# Altium schematic sheet PG02_PPG.SchDoc: Smart Ring (Concept)
size B; DocumentNumber: 2; Revision: A; SheetNumber: 2; SheetTotal: 3
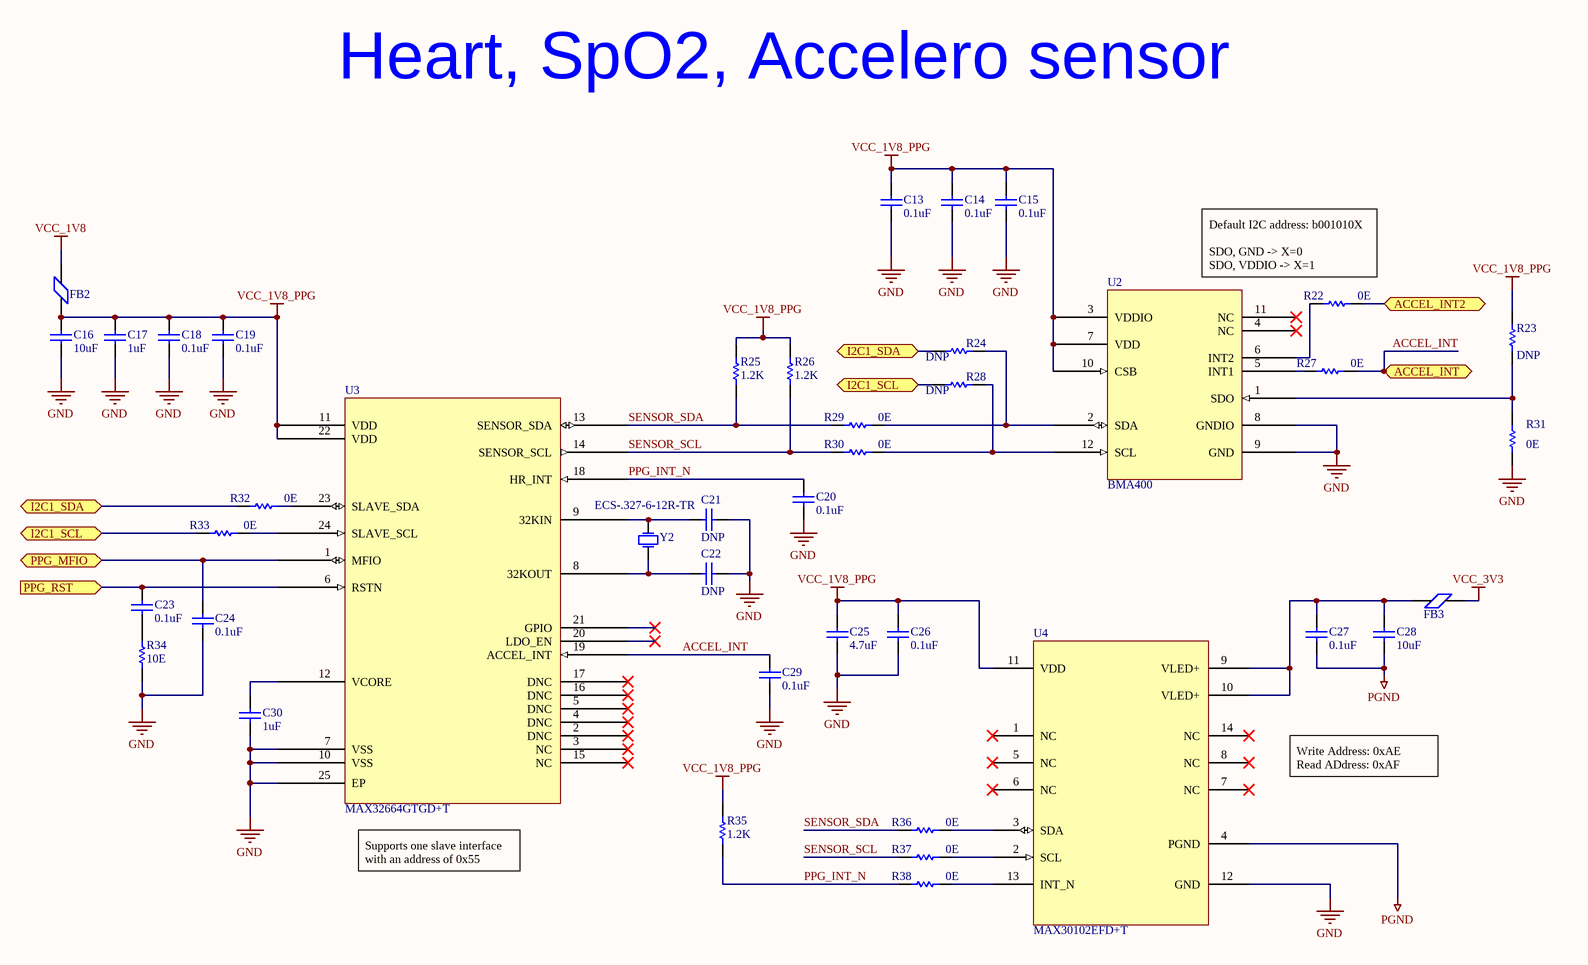
[diagram p0: PG02_PPG.SchDoc]

## Parts
C13  0.1uF  [0402C]
C14  0.1uF  [0402C]
C15  0.1uF  [0402C]
C16  10uF  [0805C]
C17  1uF  [0805C]
C18  0.1uF  [0402C]
C19  0.1uF  [0402C]
C20  0.1uF  [0402C]
C21  DNP  [0402C]
C22  DNP  [0402C]
C23  0.1uF  [0402C]
C24  0.1uF  [0402C]
C25  4.7uF  [0805C]
C26  0.1uF  [0402C]
C27  0.1uF  [0402C]
C28  10uF  [0805C]
C29  0.1uF  [0402C]
C30  1uF  [0805C]
FB2  Ferrite Bead  [0402R]  (value not drawn)
FB3  Ferrite Bead  [0402R]  (value not drawn)
R22  0E  [0402R]
R23  DNP  [0402C]
R24  DNP  [0402C]
R25  1.2K  [0402R]
R26  1.2K  [0402R]
R27  0E  [0402R]
R28  DNP  [0402C]
R29  0E  [0402R]
R30  0E  [0402R]
R31  0E  [0402R]
R32  0E  [0402R]
R33  0E  [0402R]
R34  10E  [0402R]
R35  1.2K  [0402R]
R36  0E  [0402R]
R37  0E  [0402R]
R38  0E  [0402R]
U2  BMA400  [BMA400]
U3  MAX32664GTGD+T  [MAX32664GTGA+T]
U4  MAX30102EFD+T  [MAX30101EFD+T]
Y2  ECS-.327-6-12R-TR  [ECS-.327-6-12R-TR]

## Ports
ACCEL_INT2 (bidir), ACCEL_INT (bidir), I2C1_SCL (bidir), I2C1_SDA (bidir), PPG_MFIO (bidir), PPG_RST (in)

## Nets
GND: C13.1 C14.1 C15.1 C16.1 C17.1 C18.1 C19.1 C20.1 C21.1 C22.1 C24.1 C25.1 C26.1 C29.1 C30.1 R31.1 R34.1 U2.8(GNDIO) U2.9(GND) U3.7(VSS) U3.10(VSS) U3.25(EP) U4.12(GND)
PGND: C27.1 C28.1 U4.4(PGND)
VCC_1V8: FB2.2(VREF)
VCC_1V8_PPG: C13.2 C14.2 C15.2 C16.2 C17.2 C18.2 C19.2 C25.2 C26.2 FB2.1(VREF) R23.2 R25.2 R26.2 R35.2 U2.3(VDDIO) U2.7(VDD) U2.10(CSB) U3.11(VDD) U3.22(VDD) U4.11(VDD)
VCC_3V3: FB3.2(VREF)
ACCEL_INT: C29.2 R27.2 U3.19(ACCEL_INT) ; port ACCEL_INT
ACCEL_INT2: R22.2 ; port ACCEL_INT2
I2C1_SCL: R28.2 R33.1 ; port I2C1_SCL
I2C1_SDA: R24.2 R32.1 ; port I2C1_SDA
PPG_INT_N: C20.2 R35.1 R38.1 U3.18(HR_INT)
PPG_MFIO: C24.2 U3.1(MFIO) ; port PPG_MFIO
PPG_RST: C23.2 U3.6(RSTN) ; port PPG_RST
SENSOR_SCL: R26.1 R30.1 R37.1 U3.14(SENSOR_SCL)
SENSOR_SDA: R25.1 R29.1 R36.1 U3.13(SENSOR_SDA)
NetC21_2: C21.2 U3.9(32KIN) Y2.2(OSC2)
NetC22_2: C22.2 U3.8(32KOUT) Y2.1(OSC1)
NetC23_1: C23.1 R34.2
NetC27_2: C27.2 C28.2 FB3.1(VREF) U4.9(VLED+) U4.10(VLED+)
NetC30_2: C30.2 U3.12(VCORE)
NetR22_1: R22.1 U2.6(INT2)
NetR23_1: R23.1 R31.2 U2.1(SDO)
NetR24_1: R24.1 R29.2 U2.2(SDA)
NetR27_1: R27.1 U2.5(INT1)
NetR28_1: R28.1 R30.2 U2.12(SCL)
NetR32_2: R32.2 U3.23(SLAVE_SDA)
NetR33_2: R33.2 U3.24(SLAVE_SCL)
NetR36_2: R36.2 U4.3(SDA)
NetR37_2: R37.2 U4.2(SCL)
NetR38_2: R38.2 U4.13(INT_N)

Not connected (* = marked no-connect by the designer): U2 4(NC)* 11(NC)*; U3 2(DNC)* 3(NC)* 4(DNC)* 5(DNC)* 15(NC)* 16(DNC)* 17(DNC)* 20(LDO_EN)* 21(GPIO)*; U4 1(NC)* 5(NC)* 6(NC)* 7(NC)* 8(NC)* 14(NC)*

## Notes on the sheet
- Heart, SpO2, Accelero sensor
- Default I2C address: b001010X
  SDO, GND -> X=0
  SDO, VDDIO -> X=1
- Write Address: 0xAE
  Read ADdress: 0xAF
- (near U3) Supports one slave interface with an address of 0x55

## Library data of the parts
C13-C15 C18-C20 C23 C24 C26 C27 C29 = CAP_0402_0.1uF_50V: CAP CER 0.1UF 50V X7R 0402; Alternate MFR: Samsung Electro-Mechanics; Alternate MPN: CL05B104KB54PNC; Package: 0402; Value: 0.1uF
C16 C28 = CAP_0805_10uF_16V: CAP CER 10UF 16V X7R 0805; Alternate MFR: Taiyo Yuden; Alternate MPN: EMK212BB7106MG-T; Package: 0805; Value: 10uF
C17 C30 = CAP_0805_1uF_25V: CAP CER 1UF 25V X7R 0805; Alternate MFR: Würth Elektronik; Alternate MPN: 885012207078; Package: 0805; Value: 1uF
C21 C22 = CAP_0402_DNP: CAP CER DNP 0402; MFR: Generic; MPN: Generic; Package: 0402; Value: DNP
C25 = CAP_0805_4.7uF_16V: CAP CER MLCC 4.7uF X7R 16V  0805; Alternate MFR: Murata Electronics; Alternate MPN: GRM21BR71C475ME51K; Package: 0805; Value: 4.7uF
FB2 FB3 = Ferrite Bead: CHIP BEAD 600 OHM 0402 300mA; MFR: Walsin; MPN: WLBD1005K2U601TP; Package: 0402
R22 R27 R29-R33 R36-R38 = RES_0402_0E: RES 0 OHM JUMPER 1/16W 0402; MFR: Generic; Alternate MFR: YAGEO; Alternate MPN: AC0402JR-130RL; MPN: Generic; Package: 0402; Value: 0E
R23 R24 R28 = RES_0402_DNP: RES DNP 0402; Package: 0402; Value: DNP
R25 R26 R35 = RES_0402_1.2k: RES 1.2K OHM 1% 1/16W 0402; MFR: Generic; Alternate MFR: YAGEO; Alternate MPN: RC0402FR-071K2L; MPN: Generic; Package: 0402; Value: 1.2K
R34 = RES_0402_10E: RES 10 OHM 1% 1/16W 0402; MFR: Generic; Alternate MFR: YAGEO; Alternate MPN: RC0402FR-1310RL; MPN: Generic; Package: 0402; Value: 10E
U2 = AccSensor_BMA400: ACCELEROMETER 2-16G 12LGA; MFR: Bosch; Value: BMA400; MPN: BMA400
U3 = MAX32664GTGD+T: Biometric Sensors CORTEX M4F 96MHZ ME11, TQFN 3X3; MFR: Maxim Integrated; MPN: MAX32664GTGD+T; Package: 24-TQFN (3x3)
U4 = MAX30101EFD+T: Biometric Sensors Oximeter/Heart Rate Integrated Optical Sensor; MFR: Maxim Integrated; Value: 14 OESIP; MPN: MAX30102EFD+T
Y2 = XTAL_32.768kHz: CRYSTAL 32.7680KHZ 6PF SMD; MFR: ECS Inc.; MPN: ECS-.327-6-12R-TR; Capacitance: 6pF; Value: 32.768kHz